# Altium schematic sheet 3PWR_OH_OCT1.SchDoc
size 297 x 209 mm
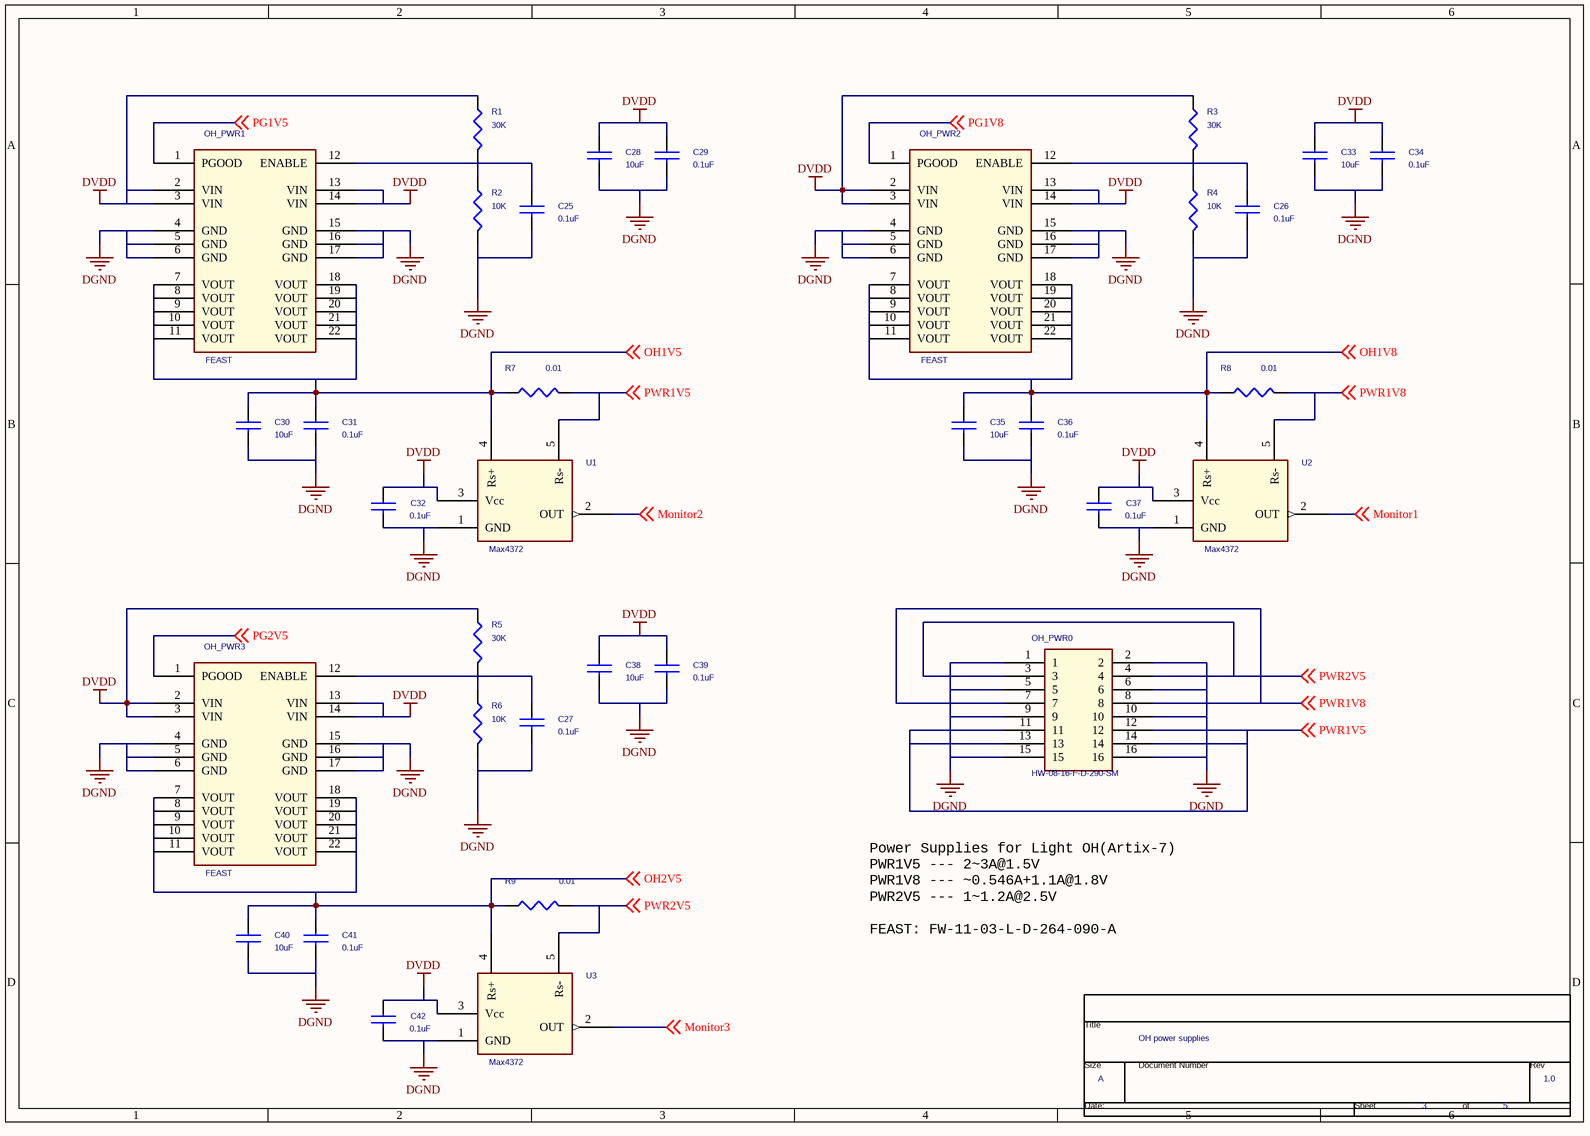
[diagram p0: 3PWR_OH_OCT1.SchDoc]

## Parts
*  Page Count: 5  Page Number: 3  Page Size: A  Title: OH power supplies  RevCode: 1.0  (hidden comment: TitleBlock0)  (graphical)
C25  0.1uF  [C0603]
C26  0.1uF  [C0603]
C27  0.1uF  [C0603]
C28  10uF  [C1206]
C29  0.1uF  [C0603]
C30  10uF  [C1206]
C31  0.1uF  [C0603]
C32  0.1uF  [C0603]
C33  10uF  [C1206]
C34  0.1uF  [C0603]
C35  10uF  [C1206]
C36  0.1uF  [C0603]
C37  0.1uF  [C0603]
C38  10uF  [C1206]
C39  0.1uF  [C0603]
C40  10uF  [C1206]
C41  0.1uF  [C0603]
C42  0.1uF  [C0603]
OH_PWR0  HW-08-16-F-D-290-SM  [HW-08-16-F-D-290-SM]
OH_PWR1  FEAST  [FW-11-03-L-D-264-090-A]
OH_PWR2  FEAST  [FW-11-03-L-D-264-090-A]
OH_PWR3  FEAST  [FW-11-03-L-D-264-090-A]
R1  30K  [R0603]
R2  10K  [R0603]
R3  30K  [R0603]
R4  10K  [R0603]
R5  30K  [R0603]
R6  10K  [R0603]
R7  0.01  [Rsense]
R8  0.01  [Rsense]
R9  0.01  [Rsense]
U1  Max4372  [sot23-5]
U2  Max4372  [sot23-5]
U3  Max4372  [sot23-5]

## Nets
DGND: C25.2 C26.2 C27.2 C28.2 C29.2 C30.2 C31.2 C32.2 C33.2 C34.2 C35.2 C36.2 C37.2 C38.2 C39.2 C40.2 C41.2 C42.2 OH_PWR0.1 OH_PWR0.2 OH_PWR0.5 OH_PWR0.6 OH_PWR0.9 OH_PWR0.10 OH_PWR0.15 OH_PWR0.16 OH_PWR1.4(GND) OH_PWR1.5(GND) OH_PWR1.6(GND) OH_PWR1.15(GND) OH_PWR1.16(GND) OH_PWR1.17(GND) OH_PWR2.4(GND) OH_PWR2.5(GND) OH_PWR2.6(GND) OH_PWR2.15(GND) OH_PWR2.16(GND) OH_PWR2.17(GND) OH_PWR3.4(GND) OH_PWR3.5(GND) OH_PWR3.6(GND) OH_PWR3.15(GND) OH_PWR3.16(GND) OH_PWR3.17(GND) R2.2 R4.2 R6.2 U1.1(GND) U2.1(GND) U3.1(GND)
DVDD: C28.1 C29.1 C32.1 C33.1 C34.1 C37.1 C38.1 C39.1 C42.1 OH_PWR1.2(VIN) OH_PWR1.3(VIN) OH_PWR1.13(VIN) OH_PWR1.14(VIN) OH_PWR2.2(VIN) OH_PWR2.3(VIN) OH_PWR2.13(VIN) OH_PWR2.14(VIN) OH_PWR3.2(VIN) OH_PWR3.3(VIN) OH_PWR3.13(VIN) OH_PWR3.14(VIN) R1.1 R3.1 R5.1 U1.3(Vcc) U2.3(Vcc) U3.3(Vcc)
Monitor1: U2.2(OUT) ; off-sheet Monitor1
Monitor2: U1.2(OUT) ; off-sheet Monitor2
Monitor3: U3.2(OUT) ; off-sheet Monitor3
OH1V5: C30.1 C31.1 OH_PWR1.7(VOUT) OH_PWR1.8(VOUT) OH_PWR1.9(VOUT) OH_PWR1.10(VOUT) OH_PWR1.11(VOUT) OH_PWR1.18(VOUT) OH_PWR1.19(VOUT) OH_PWR1.20(VOUT) OH_PWR1.21(VOUT) OH_PWR1.22(VOUT) R7.1 U1.4(Rs+) ; off-sheet OH1V5
OH1V8: C35.1 C36.1 OH_PWR2.7(VOUT) OH_PWR2.8(VOUT) OH_PWR2.9(VOUT) OH_PWR2.10(VOUT) OH_PWR2.11(VOUT) OH_PWR2.18(VOUT) OH_PWR2.19(VOUT) OH_PWR2.20(VOUT) OH_PWR2.21(VOUT) OH_PWR2.22(VOUT) R8.1 U2.4(Rs+) ; off-sheet OH1V8
OH2V5: C40.1 C41.1 OH_PWR3.7(VOUT) OH_PWR3.8(VOUT) OH_PWR3.9(VOUT) OH_PWR3.10(VOUT) OH_PWR3.11(VOUT) OH_PWR3.18(VOUT) OH_PWR3.19(VOUT) OH_PWR3.20(VOUT) OH_PWR3.21(VOUT) OH_PWR3.22(VOUT) R9.1 U3.4(Rs+) ; off-sheet OH2V5
PG1V5: OH_PWR1.1(PGOOD) ; off-sheet PG1V5
PG1V8: OH_PWR2.1(PGOOD) ; off-sheet PG1V8
PG2V5: OH_PWR3.1(PGOOD) ; off-sheet PG2V5
PWR1V5: OH_PWR0.11 OH_PWR0.12 OH_PWR0.13 OH_PWR0.14 R7.2 U1.5(Rs-) ; off-sheet PWR1V5
PWR1V8: OH_PWR0.7 OH_PWR0.8 R8.2 U2.5(Rs-) ; off-sheet PWR1V8
PWR2V5: OH_PWR0.3 OH_PWR0.4 R9.2 U3.5(Rs-) ; off-sheet PWR2V5
NetC25_1: C25.1 OH_PWR1.12(ENABLE) R1.2 R2.1
NetC26_1: C26.1 OH_PWR2.12(ENABLE) R3.2 R4.1
NetC27_1: C27.1 OH_PWR3.12(ENABLE) R5.2 R6.1

## Notes on the sheet
- (near *) Power Supplies for Light OH(Artix-7)
  PWR1V5 --- 2~3A@1.5V
  PWR1V8 --- ~0.546A+1.1A@1.8V
  PWR2V5 --- 1~1.2A@2.5V
  FEAST: FW-11-03-L-D-264-090-A
- (in symbol TitleBlock0) Title; Size; Document Number; Rev; Date:; Sheet; of

## Library data of the parts
C25-C42 = CAP NP
OH_PWR0 = HLE-108-02-F-DV-A
R1-R9 = R_Dup1
* = TitleBlock0: Page Create Date: March  8, 1995